# EAGLE design modules_ponth (EAGLE 5.11)
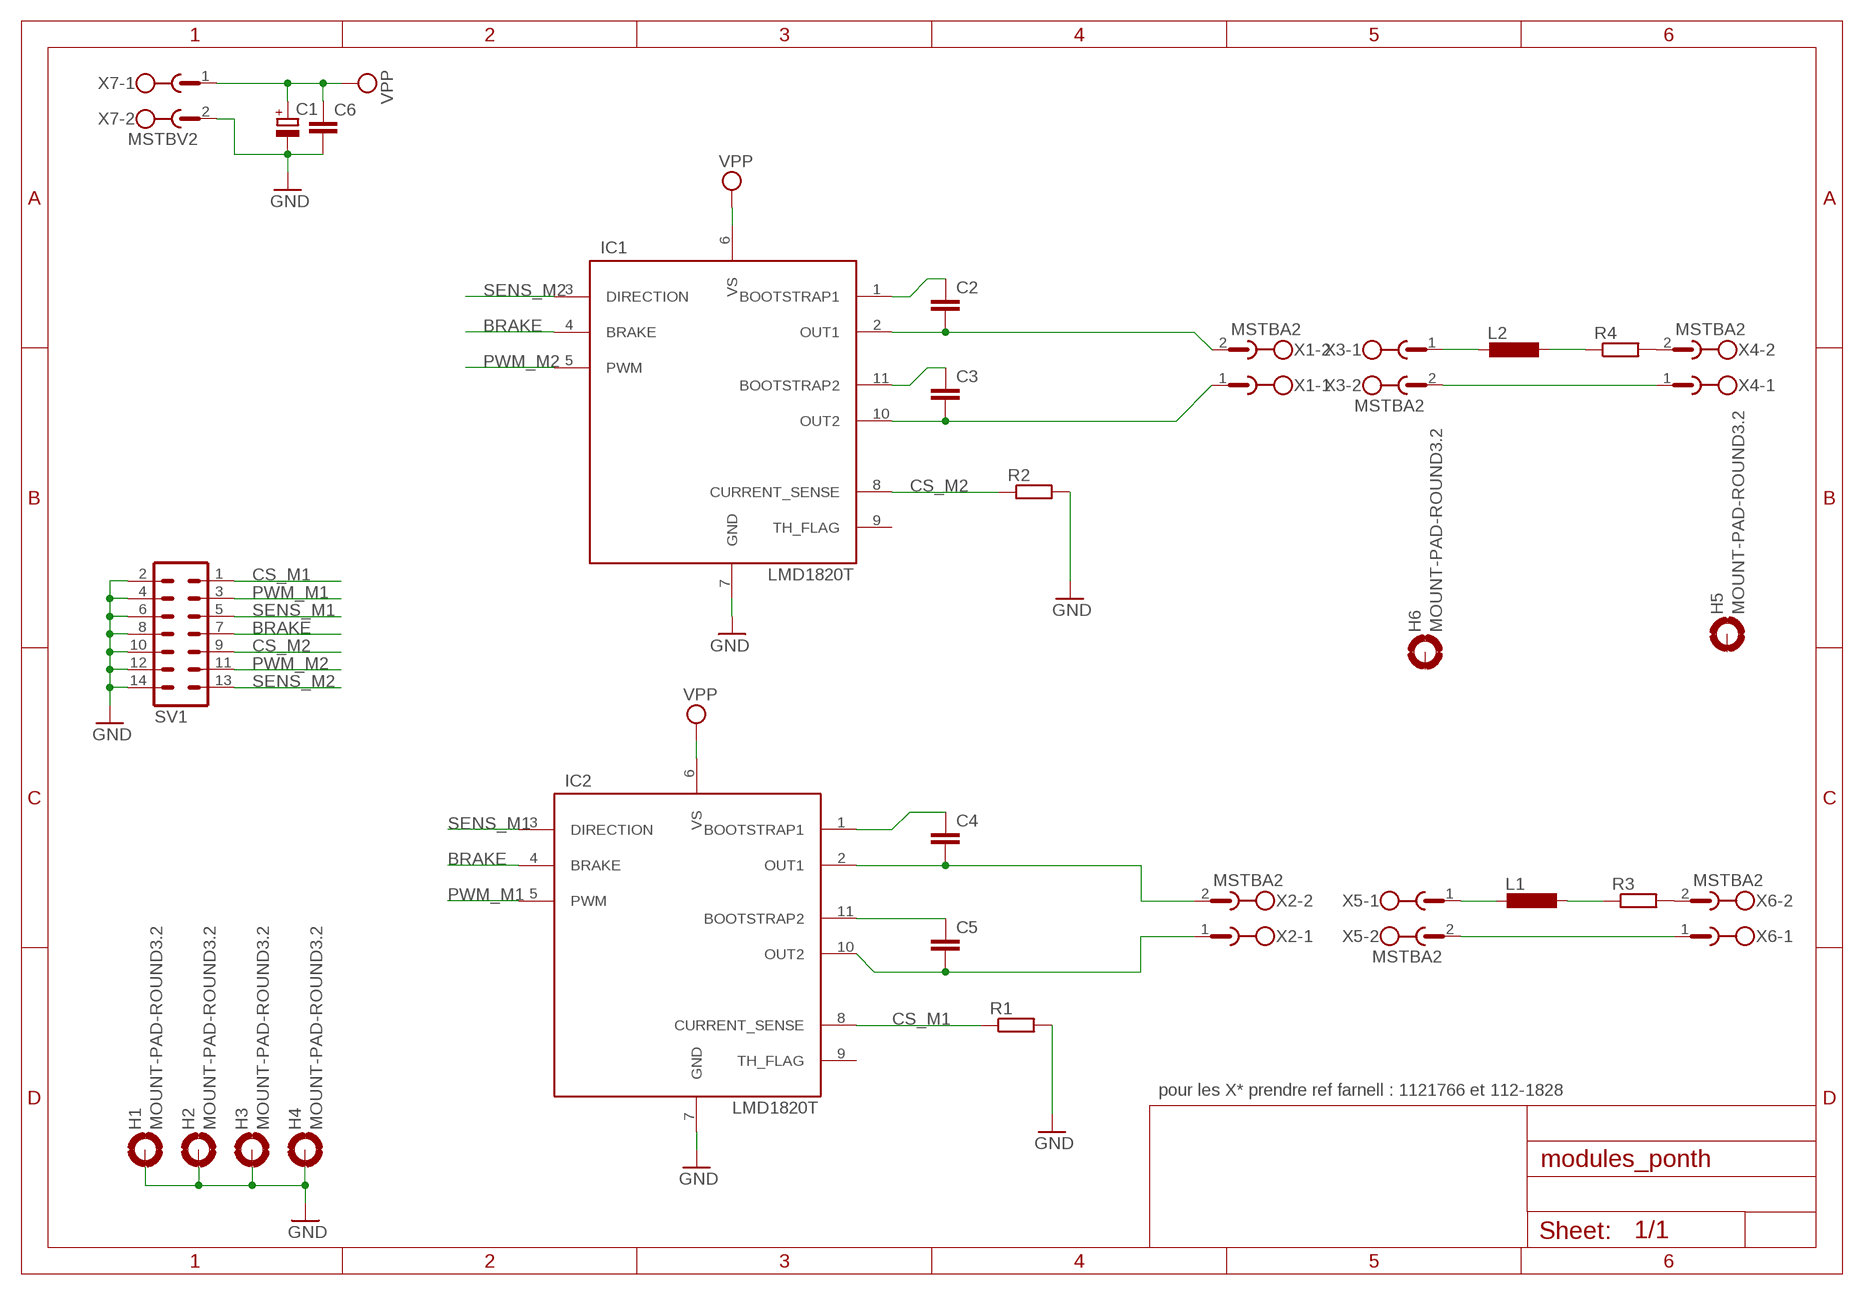
[diagram p0: schematic, sheet 1]

## Parts
C1  CPOL-EUE5-6  [E5-6]
C2  C-EU050-035X075  [C050-035X075]
C3  C-EU050-035X075  [C050-035X075]
C4  C-EU050-035X075  [C050-035X075]
C5  C-EU050-035X075  [C050-035X075]
C6  C-EU050-035X075  [C050-035X075]
H1  MOUNT-PAD-ROUND3.2  [3,2-PAD]
H2  MOUNT-PAD-ROUND3.2  [3,2-PAD]
H3  MOUNT-PAD-ROUND3.2  [3,2-PAD]
H4  MOUNT-PAD-ROUND3.2  [3,2-PAD]
H5  MOUNT-PAD-ROUND3.2  [3,2-PAD]
H6  MOUNT-PAD-ROUND3.2  [3,2-PAD]
IC1  LMD1820T  [11-TO220]
IC2  LMD1820T  [11-TO220]
L1  L-EUTJ7-U1  [TJ7-U1]
L2  L-EUTJ7-U1  [TJ7-U1]
R1  R-EU_0207/10  [0207/10]
R2  R-EU_0207/10  [0207/10]
R3  R-EU_0309/12  [0309/12]
R4  R-EU_0309/12  [0309/12]
SV1  ML14  [ML14]
X1  MSTBA2  [MSTBA2]
X2  MSTBA2  [MSTBA2]
X3  MSTBA2  [MSTBA2]
X4  MSTBA2  [MSTBA2]
X5  MSTBA2  [MSTBA2]
X6  MSTBA2  [MSTBA2]
X7  MSTBV2  [MSTBV2]

## Nets
BRAKE: IC1.4(BRAKE) IC2.4(BRAKE) SV1.7
CS_M1: IC2.8(CURRENT_SENSE) R1.1 SV1.1
CS_M2: IC1.8(CURRENT_SENSE) R2.1 SV1.9
GND: C1.- C6.2 H1.B3,2(MOUNT) H2.B3,2(MOUNT) H3.B3,2(MOUNT) H4.B3,2(MOUNT) IC1.7(GND) IC2.7(GND) R1.2 R2.2 SV1.2 SV1.4 SV1.6 SV1.8 SV1.10 SV1.12 SV1.14 X7.2
N$1: C3.1 IC1.11(BOOTSTRAP2)
N$2: C4.1 IC2.1(BOOTSTRAP1)
N$3: R4.2 X4.2
N$4: C2.2 IC1.2(OUT1) X1.2
N$5: R3.2 X6.2
N$6: C2.1 IC1.1(BOOTSTRAP1)
N$7: L2.1 R4.1
N$8: X3.2 X4.1
N$9: C3.2 IC1.10(OUT2) X1.1
N$10: L1.2 X5.1
N$11: C5.2 IC2.10(OUT2) X2.1
N$12: L1.1 R3.1
N$13: C4.2 IC2.2(OUT1) X2.2
N$14: L2.2 X3.1
N$16: X5.2 X6.1
N$17: C5.1 IC2.11(BOOTSTRAP2)
PWM_M1: IC2.5(PWM) SV1.3
PWM_M2: IC1.5(PWM) SV1.11
SENS_M1: IC2.3(DIRECTION) SV1.5
SENS_M2: IC1.3(DIRECTION) SV1.13
VPP: C1.+ C6.1 IC1.6(VS) IC2.6(VS) X7.1
Unconnected: H5.B3,2(MOUNT) H6.B3,2(MOUNT) IC1.9(TH_FLAG) IC2.9(TH_FLAG)

## Notes on the sheet
- pour les X* prendre ref farnell : 1121766 et 112-1828

## Library data of the parts
C1 = rcl:CPOL-EU: POLARIZED CAPACITOR, European symbol
C2-C6 = rcl:C-EU: CAPACITOR, European symbol
H1-H6 = holes:MOUNT-PAD-ROUND: MOUNTING PAD, round
IC1 IC2 = national-semiconductor:LMD1820T
L1 L2 = rcl:L-EU: INDUCTOR, European symbol
R1-R4 = rcl:R-EU_: RESISTOR, European symbol
SV1 = con-harting-ml:ML14: HARTING; OC_FARNELL: unknown; OC_NEWARK: unknown
X1-X6 = con-phoenix-508:MSTBA2: PHOENIX; MF: FARNELL; MPN: 1757242; OC_FARNELL: 3705171; OC_NEWARK: 71C4161
X7 = con-phoenix-508:MSTBV2: PHOENIX; MPN: MSTBV 2,5/2-GF-5.08; OC_FARNELL: 1792792; OC_NEWARK: 69R9845

## Net classes
0 default: width 0.406 mm, drill 0.7 mm

## Board
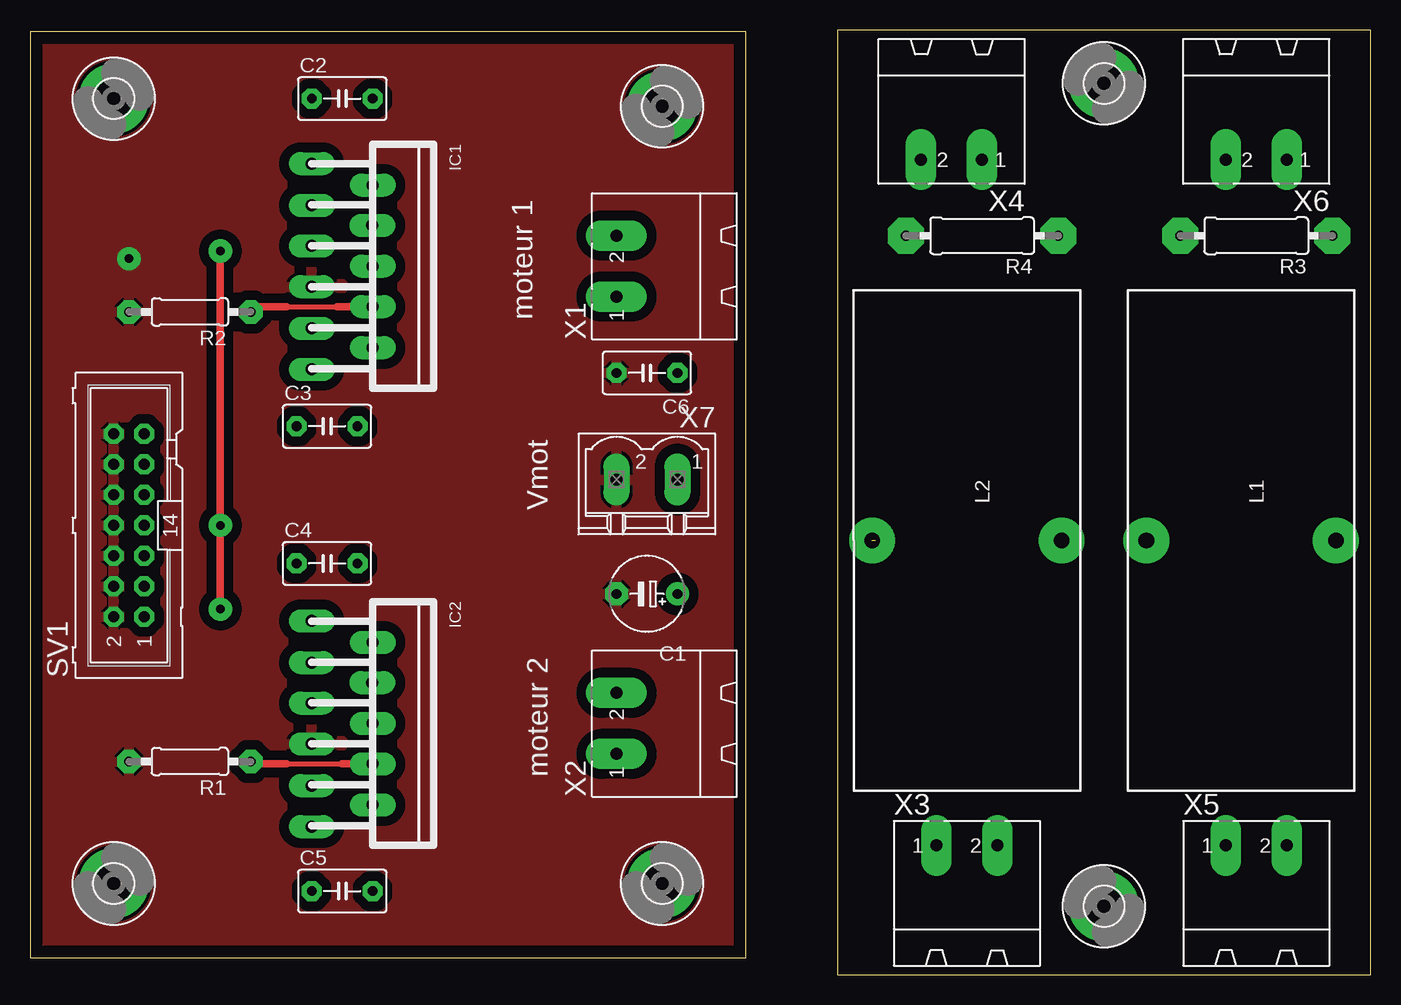
[diagram p1: board, top side]
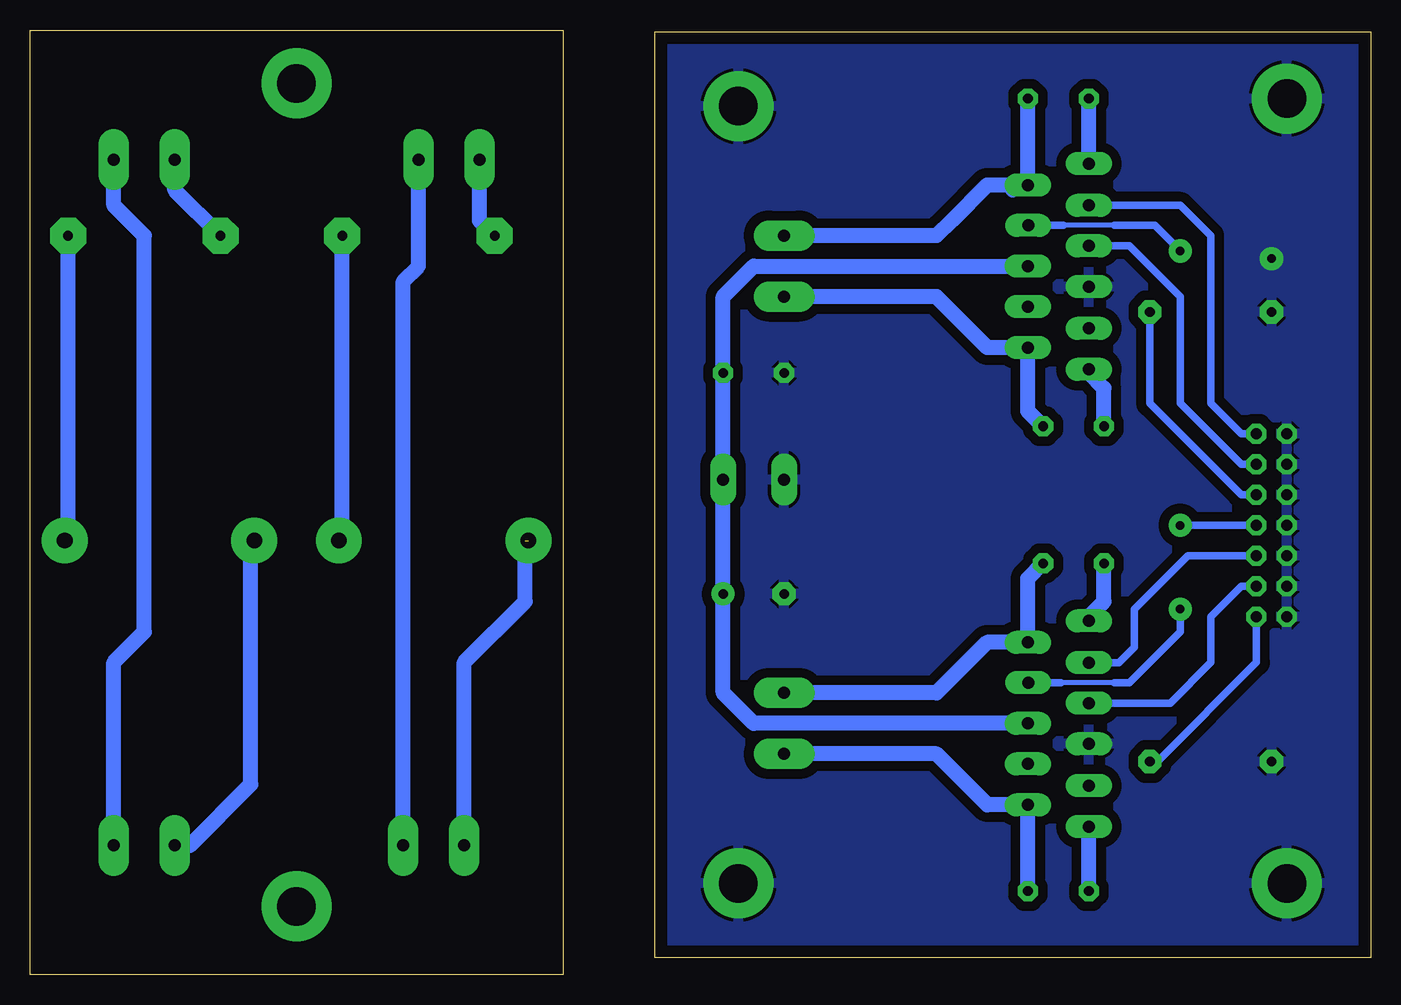
[diagram p2: board, bottom side, seen from below]

Size 111.75 x 78.74 mm. Coordinates in mm from the lower left corner, seen from the top.
Outline: 0,1.43 59.67,1.43 59.67,78.58 0,78.58 0,1.43
Outline: 67.3,0 111.75,0 111.75,78.74 67.3,78.74 67.3,0
Copper layers (1*16): Top 0.035mm / dielectric 1.5mm / Bottom 0.035mm
Design rules "default": minimum track width 10mil, minimum drill 24mil, track to track 8mil, track to pad 8mil, pad to pad 8mil, via to via 8mil, smd to smd 8mil, copper to edge 40mil, drill to drill 8mil, minimum pad ring 10mil, minimum via ring 8mil, stop-mask expansion 4mil, vias tented up to drill 0mil, thermal gap 10mil

### Footprints (pad centres in the part's own frame; a part is rotated, then mirrored left to right if it is on the bottom)
E5-6 = drill 0.813 pad 1.905 round: + -2.54,0 | drill 0.813 pad 1.905 octagon: - 2.54,0
C050-035X075 = drill 0.813 pad 1.676 octagon: 1 -2.54,0; 2 2.54,0
3,2-PAD = drill 3.2 pad 5.842 round: B3,2 0,0
11-TO220 = drill 1 pad 1.93 long: 1 -8.555,-5.08; 2 -6.75,0; 3 -5.065,-5.08; 4 -3.4,-0.03; 5 -1.7,-5.08; 6 0,0; 7 1.705,-5.08; 8 3.375,0; 9 5.18,-5.08; 10 6.785,0; 11 8.59,-5.08
TJ7-U1 = drill 1.3 pad 3.81 round: 1 -7.9,0; 2 7.9,0
0207/10 = drill 0.813 pad 1.93 octagon: 1 -5.08,0; 2 5.08,0
0309/12 = drill 0.8 pad 3 octagon: 1 -6.35,0; 2 6.35,0
ML14 = drill 0.914 pad 1.676 octagon: 1 -7.62,-1.27; 2 -7.62,1.27; 3 -5.08,-1.27; 4 -5.08,1.27; 5 -2.54,-1.27; 6 -2.54,1.27; 7 0,-1.27; 8 0,1.27; 9 2.54,-1.27; 10 2.54,1.27; 11 5.08,-1.27; 12 5.08,1.27; 13 7.62,-1.27; 14 7.62,1.27
MSTBA2 = drill 1 pad 2.54 long: 1 -2.54,5.08; 2 2.54,5.08
MSTBV2 = drill 1 pad 2.184 long: 1 -2.54,0; 2 2.54,0

### Placement (x,y rotation side)
C1  51.43,31.75 180 top
C2  26.03,73.02 0 top
C3  24.76,45.72 0 top
C4  24.76,34.29 0 top
C5  26.03,6.98 0 top
C6  51.43,50.16 180 top
H1  6.98,7.62 0 top
H2  6.98,73.02 0 top
H3  52.7,7.62 0 top
H4  52.7,72.39 0 top
H5  89.53,5.71 90 top
H6  89.53,74.3 90 top
IC1  28.57,59.05 270 top
IC2  28.57,20.96 270 top
L1  100.96,36.2 180 top
L2  78.1,36.2 180 top
R1  13.33,17.78 180 top
R2  13.33,55.24 180 top
R3  102.23,61.59 180 top
R4  79.37,61.59 180 top
SV1  8.25,37.46 90 top
X1  53.97,59.05 90 top
X2  53.97,20.96 90 top
X3  78.1,5.71 0 top
X4  76.83,73.02 180 top
X5  102.23,5.71 0 top
X6  102.23,73.02 180 top
X7  51.43,41.27 180 top

### Tracks (layer width: path | path; a pad name or v marks a point on that pad's centre or on a via)
BRAKE  (via drill 0.7 pad 1.93)
  Top 0.61: v15.87,30.48 v15.87,37.46 v15.87,60.32
  Bottom 0.406: 21.36,62.45 25.62,62.45 | 21.36,24.36 25.8,24.36
  Bottom 0.61: 25.8,24.36 IC2.4 | 25.62,62.45 IC1.4 | 21.36,62.45 18,62.45 v15.87,60.32 | 21.36,24.36 20.09,24.36 15.87,28.57 v15.87,30.48 | v15.87,37.46 SV1.7
CS_M1
  Top 0.406: 21.38,17.58 26.03,17.58
  Top 0.61: 26.03,17.58 IC2.8 | 21.38,17.58 18.61,17.58 R1.1
  Bottom 0.61: SV1.1 9.52,26.04 17.77,17.78 R1.1
CS_M2
  Top 0.406: 21.38,55.68 25.59,55.68
  Top 0.61: 25.59,55.68 IC1.8 | 21.38,55.68 18.84,55.68 R2.1
  Bottom 0.61: R2.1 18.41,47.62 10.79,40 SV1.9
GND  (via drill 0.7 pad 1.93)
  other vias: 8.25,59.69
  pour Bottom (isolate 0.813): 0.63,78.11 59.05,78.11 59.05,1.9 0.63,1.9
  pour Top (isolate 0.813): 0.63,78.11 59.05,78.11 59.05,1.9 0.63,1.9
N$1
  Bottom 0.406: 23.49,50.16 IC1.11
  Bottom 1.27: C3.1 22.22,48.89 23.49,50.16
N$2
  Bottom 0.406: IC2.1 23.49,29.85
  Bottom 1.27: 23.49,29.85 22.22,31.12 C4.1
N$3
  Bottom 1.27: X4.2 74.29,62.86 R4.2
N$4
  Bottom 1.27: IC1.2 31.98,65.81 34.92,62.86 36.19,61.59 X1.2 | IC1.2 29.84,65.41 | IC1.2 C2.2
N$5
  Bottom 1.27: X6.2 99.69,65.41 R3.2
N$6
  Bottom 1.27: IC1.1 C2.1
N$7
  Bottom 1.27: L2.1 85.72,36.2 R4.1
N$8
  Bottom 1.27: X3.2 80.64,57.78 79.37,59.05 X4.1
N$9
  Bottom 1.27: C3.2 28.57,46.99 IC1.10 31.95,52.27 36.19,56.52 X1.1
N$10
  Bottom 1.27: L1.2 93.34,36.2 93.34,15.88 98.42,10.79 X5.1
N$11
  Bottom 0.406: IC2.10 29.84,14.61
  Bottom 1.27: C5.2 IC2.10 31.95,14.17 36.19,18.41 X2.1
N$12
  Bottom 1.27: L1.1 108.58,36.2 R3.1
N$13
  Bottom 0.406: IC2.2 29.84,27.3
  Bottom 1.27: C4.2 28.57,33.02 IC2.2 31.98,27.71 36.19,23.5 X2.2
N$14  (1 unrouted)
  Bottom 1.27: X3.1 75.56,26.04 70.48,31.12 70.48,36.2
N$16
  Bottom 1.27: X6.1 104.77,64.14 102.23,61.59 102.23,28.57 104.77,26.04 X5.2
N$17
  Bottom 1.27: C5.1 IC2.11
PWM_M1
  Bottom 0.61: SV1.3 10.79,32.38 13.33,29.85 13.33,26.04 16.71,22.66 IC2.5
PWM_M2
  Bottom 0.61: IC1.5 20.11,60.75 15.87,56.52 15.87,47.62 10.79,42.54 SV1.11
SENS_M1
  Bottom 0.61: IC2.3 20.96,26.02 19.68,27.3 19.68,30.48 15.24,34.92 SV1.5
SENS_M2
  Bottom 0.61: IC1.3 15.86,64.12 13.33,61.59 13.33,47.62 10.79,45.08 SV1.13
VPP
  Bottom 1.27: IC2.6 51.43,20.96 53.97,23.5 C1.+ X7.1 C6.1 53.97,56.52 51.43,59.05 IC1.6

### Text on the board
tPlace: moteur 1 | Vmot | moteur 2